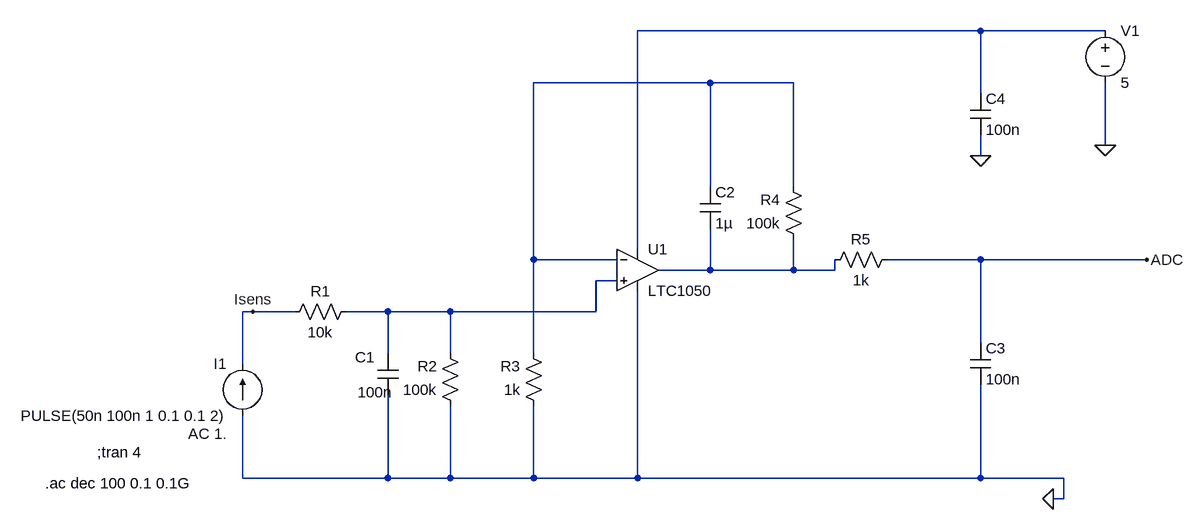
[diagram p0: schematic full.asc]
full.asc, the LTspice schematic file:
Version 4
SHEET 1 1724 680
WIRE 800 -384 272 -384
WIRE 992 -384 800 -384
WIRE 384 -304 112 -304
WIRE 512 -304 384 -304
WIRE 800 -288 800 -384
WIRE 992 -208 992 -304
WIRE 800 -192 800 -224
WIRE 384 -144 384 -304
WIRE 512 -144 512 -304
WIRE 272 -48 272 -384
WIRE 112 -32 112 -304
WIRE 240 -32 112 -32
WIRE 800 -32 656 -32
WIRE 1056 -32 800 -32
WIRE 384 -16 384 -80
WIRE 384 -16 304 -16
WIRE 512 -16 512 -64
WIRE 512 -16 384 -16
WIRE 576 -16 576 -32
WIRE 576 -16 512 -16
WIRE 240 0 208 0
WIRE -320 48 -336 48
WIRE -256 48 -320 48
WIRE -112 48 -176 48
WIRE -16 48 -112 48
WIRE 208 48 208 0
WIRE 208 48 -16 48
WIRE 800 96 800 -32
WIRE -112 112 -112 48
WIRE -16 112 -16 48
WIRE 112 112 112 -32
WIRE -336 128 -336 48
WIRE -336 304 -336 208
WIRE -112 304 -112 176
WIRE -112 304 -336 304
WIRE -16 304 -16 192
WIRE -16 304 -112 304
WIRE 112 304 112 192
WIRE 112 304 -16 304
WIRE 272 304 272 16
WIRE 272 304 112 304
WIRE 800 304 800 160
WIRE 800 304 272 304
WIRE 928 304 800 304
WIRE 928 336 928 304
WIRE 928 336 912 336
FLAG 800 -192 0
FLAG 912 336 0
FLAG 1056 -32 ADC
FLAG -320 48 Isens
FLAG 992 -208 0
SYMBOL res -160 32 R90
WINDOW 0 0 56 VBottom 2
WINDOW 3 32 56 VTop 2
SYMATTR InstName R1
SYMATTR Value 10k
SYMBOL res 0 208 R180
WINDOW 0 36 76 Left 2
WINDOW 3 36 40 Left 2
SYMATTR InstName R2
SYMATTR Value 100k
SYMBOL res 128 208 R180
WINDOW 0 36 76 Left 2
WINDOW 3 36 40 Left 2
SYMATTR InstName R3
SYMATTR Value 1k
SYMBOL res 528 -48 R180
WINDOW 0 36 76 Left 2
WINDOW 3 36 40 Left 2
SYMATTR InstName R4
SYMATTR Value 100k
SYMBOL res 560 -16 R270
WINDOW 0 32 56 VTop 2
WINDOW 3 0 56 VBottom 2
SYMATTR InstName R5
SYMATTR Value 1k
SYMBOL cap -128 112 R0
WINDOW 0 -35 6 Left 2
WINDOW 3 -31 60 Left 2
SYMATTR InstName C1
SYMATTR Value 100n
SYMBOL cap 368 -144 R0
SYMATTR InstName C2
SYMATTR Value 1µ
SYMBOL cap 784 96 R0
SYMATTR InstName C3
SYMATTR Value 100n
SYMBOL cap 784 -288 R0
SYMATTR InstName C4
SYMATTR Value 100n
SYMBOL OpAmps\\LTC1050 272 -80 R0
SYMATTR InstName U1
SYMBOL voltage 992 -400 R0
WINDOW 123 0 0 Left 0
WINDOW 39 0 0 Left 0
SYMATTR InstName V1
SYMATTR Value 5
SYMBOL current -336 208 R180
WINDOW 0 24 80 Left 2
WINDOW 3 24 0 Left 2
WINDOW 123 24 -28 Left 2
WINDOW 39 0 0 Left 0
SYMATTR InstName I1
SYMATTR Value PULSE(50n 100n 1 0.1 0.1 2)
SYMATTR Value2 AC 1.
TEXT -560 264 Left 2 !;tran 4
TEXT -640 312 Left 2 !.ac dec 100 0.1 0.1G

The netlist it stands for:
* full.asc
R1 N004 Isens 10k
R2 0 N004 100k
R3 0 N002 1k
R4 N003 N002 100k
R5 N003 ADC 1k
C1 N004 0 100n
C2 N002 N003 1µ
C3 ADC 0 100n
C4 N001 0 100n
XU1 N004 N002 N001 0 N003 LTC1050  ; pins In+ In- V+ V- OUT
V1 N001 0 5
I1 0 Isens PULSE(50n 100n 1 0.1 0.1 2) AC 1.
;tran 4
.ac dec 100 0.1 0.1G
.lib LTC.lib
.backanno
.end